# EAGLE design atmduinov2 (EAGLE 7.2.0)
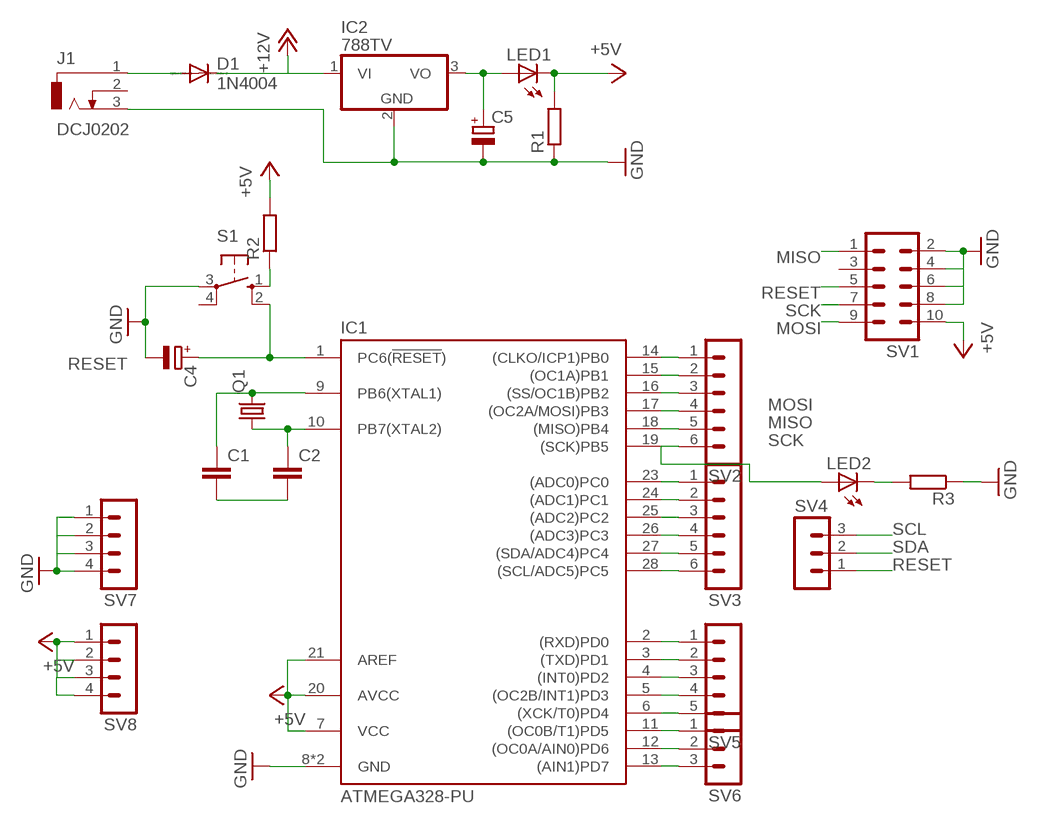
[diagram p0: schematic, sheet 1]

## Parts
C1  C-EU025-024X044  [C025-024X044]
C2  C-EU025-024X044  [C025-024X044]
C4  CPOL-EUE1.8-4  [E1,8-4]
C5  CPOL-EUE1.8-4  [E1,8-4]
D1  1N4004  [DO41-10]
IC1  ATMEGA328-PU  [DIL28]
IC2  788TV  [TO220V]
J1  DCJ0202  [DCJ0202]
LED1  LED3MM  [LED3MM]
LED2  LED3MM  [LED3MM]
Q1  CRYSTALHC49S  [HC49/S]
R1  R-EU_0204/5  [0204/5]
R2  R-EU_0204/5  [0204/5]
R3  R-EU_0204/5  [0204/5]
S1  10-XX  [B3F-10XX]
SV1  ML10  [ML10]
SV2  MA06-1  [MA06-1]
SV3  MA06-1  [MA06-1]
SV4  MA03-1  [MA03-1]
SV5  MA05-1  [MA05-1]
SV6  MA03-1  [MA03-1]
SV7  MA04-1  [MA04-1]
SV8  MA04-1  [MA04-1]

## Nets
+5V: IC1.7(VCC) IC1.20(AVCC) IC1.21(AREF) LED1.K(C) R1.2 R2.2 SV1.10 SV8.1 SV8.2 SV8.3 SV8.4
+12V: D1.C IC2.1(VI)
GND: C4.- C5.- IC1.8(GND) IC1.22(GND) IC2.2(GND) J1.3 R1.1 R3.1 S1.3(P) SV1.2 SV1.4 SV1.6 SV1.8 SV7.1 SV7.2 SV7.3 SV7.4
MISO: IC1.18((MISO)PB4) SV1.1 SV2.5
MOSI: IC1.17((OC2A/MOSI)PB3) SV1.9 SV2.4
N$1: D1.A J1.1
N$2: C5.+ IC2.3(VO) LED1.A
N$3: LED2.K(C) R3.2
N$4: IC1.14((CLKO/ICP1)PB0) SV2.1
N$5: IC1.15((OC1A)PB1) SV2.2
N$6: IC1.16((SS/OC1B)PB2) SV2.3
N$10: IC1.23((ADC0)PC0) SV3.1
N$11: IC1.24((ADC1)PC1) SV3.2
N$12: IC1.25((ADC2)PC2) SV3.3
N$13: IC1.26((ADC3)PC3) SV3.4
N$16: IC1.2((RXD)PD0) SV5.1
N$17: IC1.3((TXD)PD1) SV5.2
N$18: IC1.4((INT0)PD2) SV5.3
N$19: IC1.5((OC2B/INT1)PD3) SV5.4
N$20: IC1.6((XCK/T0)PD4) SV5.5
N$21: IC1.11((OC0B/T1)PD5) SV6.1
N$22: IC1.12((OC0A/AIN0)PD6) SV6.2
N$23: IC1.13((AIN1)PD7) SV6.3
N$24: C2.1 IC1.10(PB7(XTAL2)) Q1.1
N$25: C1.1 IC1.9(PB6(XTAL1)) Q1.2
N$26: C1.2 C2.2
N$29: R2.1 S1.1(S)
RESET: C4.+ IC1.1(PC6(!RESET!)) S1.2(S1) SV1.5 SV4.1
SCK: IC1.19((SCK)PB5) LED2.A SV1.7 SV2.6
SCL: IC1.28((SCL/ADC5)PC5) SV3.6 SV4.3
SDA: IC1.27((SDA/ADC4)PC4) SV3.5 SV4.2
Unconnected: J1.2 S1.4(P1) SV1.3

## Library data of the parts
C1 C2 = resistor:C-EU: CAPACITOR, European symbol
C4 C5 = resistor:CPOL-EU: POLARIZED CAPACITOR, European symbol
D1 = diode:1N4004: DIODE general purpose rectifier, 1 A
IC1 = ATMEGA328-PU:ATMEGA328-PU: Atmel ATmega48/88/168/328 AVR Microcontroller; AVAILABILITY: Good; DESCRIPTION: ATmega Series 20 MHz 32 KB Flash 2 KB SRAM 8-Bit Microcontroller - DIP-28; MF: Microchip; MP: ATMEGA328-PU; PACKAGE: PDIP-28 Microchip; PRICE: 1.95 USD
IC2 = linear:78*: Positive VOLTAGE REGULATOR Source: http://cache.national.com/ds/LM/LM78L05.pdf http://www.fairchildsemi.com/ds/LM/LM7805.pdf
J1 = con-jack:DCJ0202: DC POWER JACK Source: DCJ0202.pdf; OC_FARNELL: unknown; OC_NEWARK: unknown
LED1 LED2 = led:LED: LED OSRAM: - CHIPLED LG R971, LG N971, LY N971, LG Q971, LY Q971, LO R971, LY R971 LH N974, LH R974 LS Q976, LO Q976, LY Q976 LO Q996 - Hyper CHIPLED LW Q18S LB Q993, LB Q99A, LB R99A - SideLED LS A670, LO A670, LY A670, LG A670, LP A670 LB A673, LV A673, LT A673, LW A673 LH A674 LY A675 LS A676, LA A676, LO A676, LY A676, LW A676 LS A679, LY A679, LG A679 - Hyper Micro SIDELED® LS Y876, LA Y876, LO Y876, LY Y876 LT Y87S - SmartLED LW L88C, LW L88S LB L89C, LB L89S, LG L890 LS L89K, LO L89K, LY L89K LS L896, LA L896, LO L896, LY L896 - TOPLED LS T670, LO T670, LY T670, LG T670, LP T670 LSG T670, LSP T670, LSY T670, LOP T670, LYG T670 LG T671, LOG T671, LSG T671 LB T673, LV T673, LT T673, LW T673 LH T674 LS T676, LA T676, LO T676, LY T676, LB T676, LH T676, LSB T676, LW T676 LB T67C, LV T67C, LT T67C, LS T67K, LO T67K, LY T67K, LW E67C LS E67B, LA E67B, LO E67B, LY E67B, LB E67C, LV E67C, LT E67C LW T67C LS T679, LY T679, LG T679 LS T770, LO T770, LY T770, LG T770, LP T770 LB T773, LV T773, LT T773, LW T773 LH T774 LS E675, LA E675, LY E675, LS T675 LS T776, LA T776, LO T776, LY T776, LB T776 LHGB T686 LT T68C, LB T68C - Hyper Mini TOPLED® LB M676 - Mini TOPLED Santana® LG M470 LS M47K, LO M47K, LY M47K Source: http://www.osram.convergy.de LUXEON: - LUMILED® LXK2-PW12-R00, LXK2-PW12-S00, LXK2-PW14-U00, LXK2-PW14-V00 LXK2-PM12-R00, LXK2-PM12-S00, LXK2-PM14-U00 LXK2-PE12-Q00, LXK2-PE12-R00, LXK2-PE12-S00, LXK2-PE14-T00, LXK2-PE14-U00 LXK2-PB12-K00, LXK2-PB12-L00, LXK2-PB12-M00, LXK2-PB14-N00, LXK2-PB14-P00, LXK2-PB14-Q00 LXK2-PR12-L00, LXK2-PR12-M00, LXK2-PR14-Q00, LXK2-PR14-R00 LXK2-PD12-Q00, LXK2-PD12-R00, LXK2-PD12-S00 LXK2-PH12-R00, LXK2-PH12-S00 LXK2-PL12-P00, LXK2-PL12-Q00, LXK2-PL12-R00 Source: www.luxeon.com KINGBRIGHT: KA-3528ASYC Source: www.kingbright.com
Q1 = crystal:CRYSTAL: CRYSTAL; OC_FARNELL: 1667008; OC_NEWARK: unknown
R1-R3 = resistor:R-EU_: RESISTOR, European symbol
S1 = switch-omron:10-XX: OMRON SWITCH; MPN: B3F-1000; OC_FARNELL: 176432; OC_NEWARK: 36M3542
SV1 = con-ml:ML10: HARTING; OC_FARNELL: unknown; OC_NEWARK: unknown
SV2 SV3 = con-lstb:MA06-1: PIN HEADER; OC_FARNELL: unknown; OC_NEWARK: unknown
SV4 SV6 = con-lstb:MA03-1: PIN HEADER; OC_FARNELL: unknown; OC_NEWARK: unknown
SV5 = con-lstb:MA05-1: PIN HEADER; OC_FARNELL: unknown; OC_NEWARK: unknown
SV7 SV8 = con-lstb:MA04-1: PIN HEADER; OC_FARNELL: unknown; OC_NEWARK: unknown

## Board
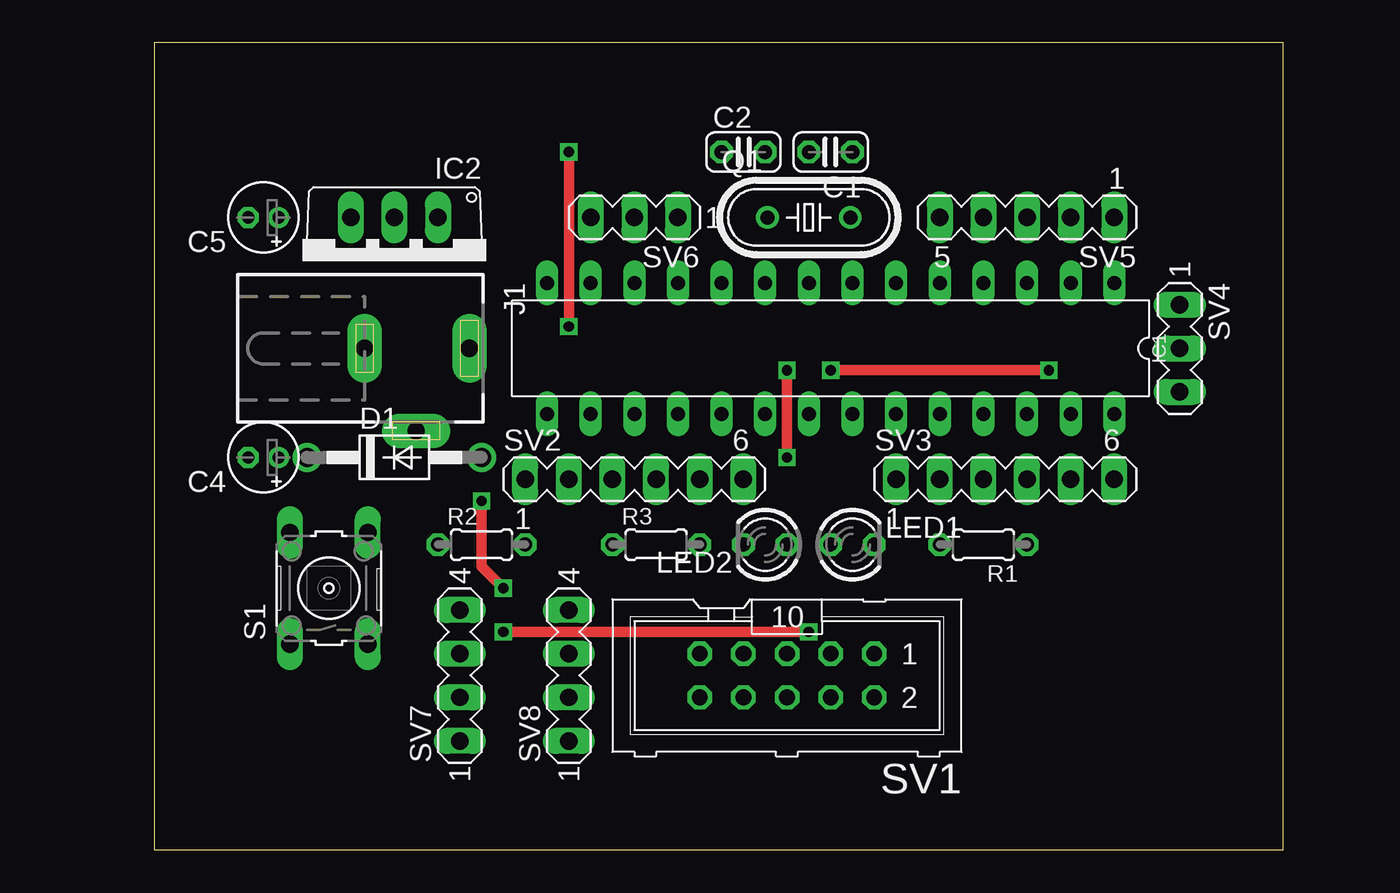
[diagram p1: board, top side]
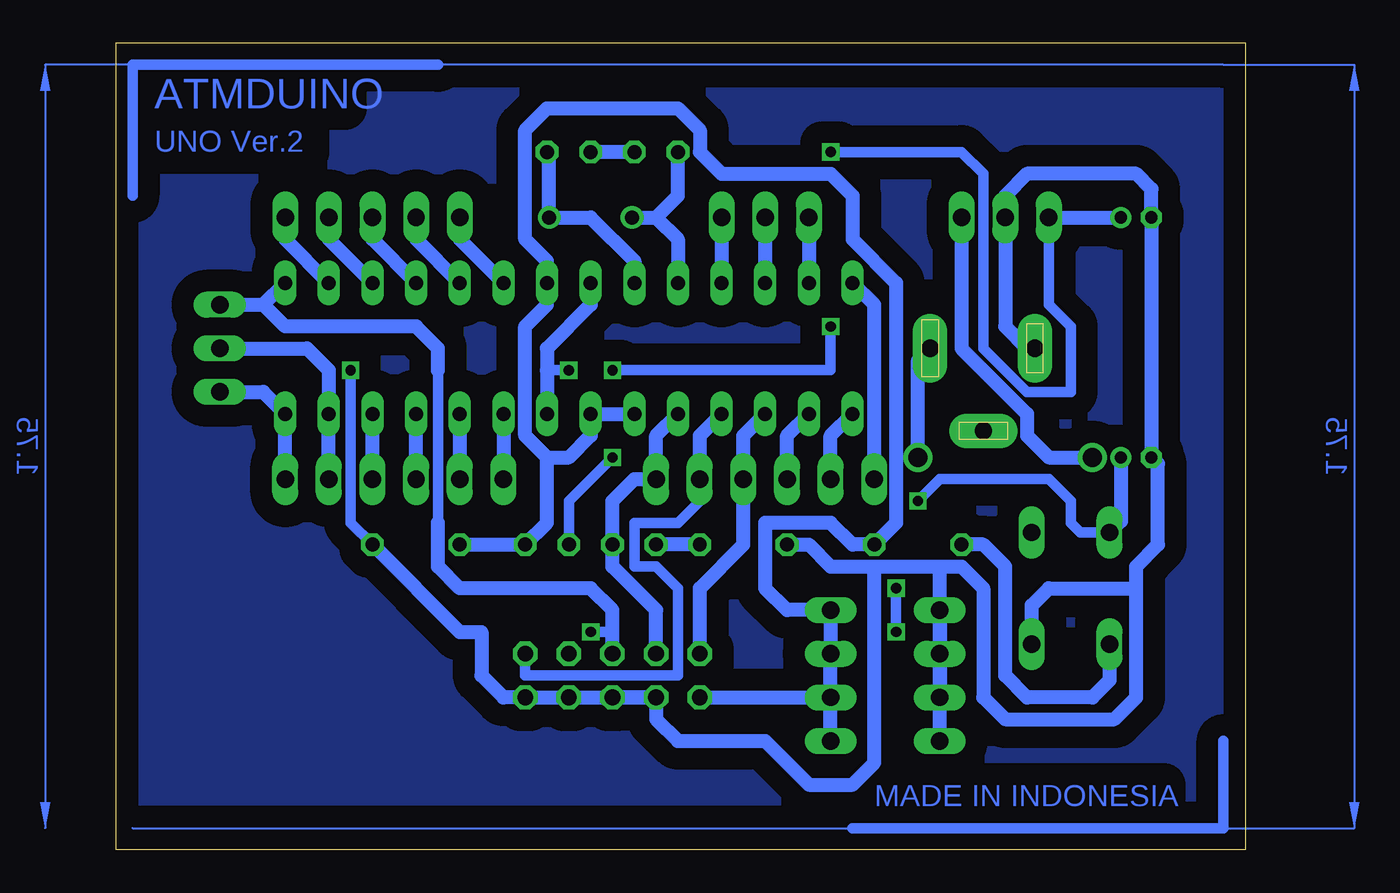
[diagram p2: board, bottom side, seen from below]

Size 65.71 x 46.97 mm. Coordinates in mm from the lower left corner, seen from the top.
Outline: 0,46.97 0,0 65.71,0 65.71,46.97 0,46.97
Copper layers (1*16): Top 0.035mm / dielectric 1.5mm / Bottom 0.035mm
Design rules "default": minimum track width 10mil, minimum drill 24mil, track to track 8mil, track to pad 8mil, pad to pad 8mil, via to via 8mil, smd to smd 8mil, copper to edge 40mil, drill to drill 8mil, minimum pad ring 10mil, minimum via ring 8mil, stop-mask expansion 4mil, vias tented up to drill 0mil, thermal gap 10mil

### Footprints (pad centres in the part's own frame; a part is rotated, then mirrored left to right if it is on the bottom)
C025-024X044 = drill 0.813 octagon: 1 -1.27,0; 2 1.27,0
E1,8-4 = drill 0.711 pad 1.168: + -0.889,0 | drill 0.711 pad 1.168 octagon: - 0.889,0
DO41-10 = drill 1.118: A 5.08,0; C -5.08,0
DIL28 = drill 0.813 long: 1 -3.81,16.51; 2 -3.81,13.97; 3 -3.81,11.43; 4 -3.81,8.89; 5 -3.81,6.35; 6 -3.81,3.81; 7 -3.81,1.27; 8 -3.81,-1.27; 9 -3.81,-3.81; 10 -3.81,-6.35; 11 -3.81,-8.89; 12 -3.81,-11.43; 13 -3.81,-13.97; 14 -3.81,-16.51; 15 3.81,-16.51; 16 3.81,-13.97; 17 3.81,-11.43; 18 3.81,-8.89; 19 3.81,-6.35; 20 3.81,-3.81; 21 3.81,-1.27; 22 3.81,1.27; 23 3.81,3.81; 24 3.81,6.35; 25 3.81,8.89; 26 3.81,11.43; 27 3.81,13.97; 28 3.81,16.51
TO220V = drill 1.016 long: 1 -2.54,-2.54; 2 0,-2.54; 3 2.54,-2.54
DCJ0202 = drill 1 pad 2 long: 1 0,3.1; 2 4.8,0; 3 0,-3
LED3MM = drill 0.813 octagon: A -1.27,0; K 1.27,0
HC49/S = drill 0.813: 1 -2.413,0; 2 2.413,0
0204/5 = drill 0.813 octagon: 1 -2.54,0; 2 2.54,0
B3F-10XX = drill 1.016 long: 1 -3.251,2.261; 2 3.251,2.261; 3 -3.251,-2.261; 4 3.251,-2.261
ML10 = drill 0.914 octagon: 1 -5.08,-1.27; 2 -5.08,1.27; 3 -2.54,-1.27; 4 -2.54,1.27; 5 0,-1.27; 6 0,1.27; 7 2.54,-1.27; 8 2.54,1.27; 9 5.08,-1.27; 10 5.08,1.27
MA06-1 = drill 1.016 long: 1 -6.35,0; 2 -3.81,0; 3 -1.27,0; 4 1.27,0; 5 3.81,0; 6 6.35,0
MA03-1 = drill 1.016 long: 1 -2.54,0; 2 0,0; 3 2.54,0
MA05-1 = drill 1.016 long: 1 -5.08,0; 2 -2.54,0; 3 0,0; 4 2.54,0; 5 5.08,0
MA04-1 = drill 1.016 long: 1 -3.81,0; 2 -1.27,0; 3 1.27,0; 4 3.81,0

### Placement (x,y rotation side)
C1  39.37,40.62 180 top
C2  34.29,40.62 0 top
C4  6.35,22.84 180 top
C5  6.35,36.81 180 top
D1  13.97,22.84 0 top
IC1  39.37,29.19 270 top
IC2  13.97,34.27 180 top
J1  15.24,29.19 270 top
LED1  40.64,17.76 0 top
LED2  35.56,17.76 180 top
Q1  38.1,36.81 0 top
R1  48.26,17.76 180 top
R2  19.05,17.76 0 top
R3  29.21,17.76 0 top
S1  10.16,15.22 90 top
SV1  36.83,10.14 180 top
SV2  27.94,21.57 0 top
SV3  49.53,21.57 0 top
SV4  59.69,29.19 270 top
SV5  50.8,36.81 180 top
SV6  27.94,36.81 180 top
SV7  17.78,10.14 90 top
SV8  24.13,10.14 90 top

### Tracks (layer width: path | path; a pad name or v marks a point on that pad's centre or on a via)
+5V
  Bottom 0.813: R1.2 LED1.K 40.64,19.03 40.64,22.84 | SV8.1 SV8.2 | SV8.2 SV8.3 SV8.4 26.67,13.95 27.94,15.22 27.94,19.03 24.13,19.03 22.86,17.76 R2.2 20.32,19.03 20.32,33 22.86,35.54 22.86,38.08 24.13,39.35 30.48,39.35 31.75,40.62 31.75,41.89 33.02,43.16 40.64,43.16 41.91,41.89 41.91,35.54 40.64,34.27 IC1.7 40.64,31.73 41.91,30.46 41.91,24.11 40.64,22.84 | IC1.20 IC1.21 38.1,24.11 39.37,22.84 40.64,22.84 | SV1.10 SV8.2
+12V
  Bottom 0.813: IC2.1 16.51,29.19 12.7,25.38 12.7,24.11 11.43,22.84 D1.C
GND  (via drill 0.6)
  Top 0.61: v52.07,27.92 v39.37,27.92
  Bottom 0.61: R1.1 52.07,19.03 v52.07,27.92 | v39.37,27.92 40.64,27.92
  Bottom 0.813: SV1.2 SV1.4 SV1.6 SV1.8 | J1.3 12.7,29.19 13.97,30.46 IC2.2 13.97,38.08 12.7,39.35 6.35,39.35 5.46,38.46 C5.- C4.- 5.08,22.46 5.08,17.76 6.35,16.49 6.35,15.22 | SV7.1 SV7.2 | SV7.2 SV7.3 SV7.4 SV7.2 | S1.3 12.42,14.23 11.43,15.22 6.35,15.22 | SV1.2 43.18,8.87 44.45,10.14 44.45,12.68 45.72,12.68 R1.1 | IC1.8 38.1,31.73 40.64,29.19 40.64,27.92 IC1.22 | R3.1 25.4,17.76 24.13,16.49 21.59,16.49 | 17.78,16.49 16.51,16.49 15.24,15.22 15.24,8.87 13.97,7.6 7.62,7.6 6.35,8.87 6.35,15.22 | SV7.2 17.78,16.49 | SV1.2 SV1.8 | SV1.8 34.29,7.6 33.02,6.33 27.94,6.33 25.4,3.79 22.86,3.79 21.59,5.06 21.59,16.49 | 21.59,16.49 17.78,16.49
MISO
  Bottom 0.61: SV1.1 41.91,10.14 33.02,10.14 33.02,15.22 34.29,16.49 35.56,16.49 35.56,19.03 33.02,19.03 31.75,20.3 SV2.5
  Bottom 0.813: SV2.5 31.75,24.11 IC1.18
MOSI
  Bottom 0.813: IC1.17 29.21,24.11 SV2.4 29.21,17.76 31.75,15.22 SV1.9
N$1
  Bottom 0.813: D1.A 19.05,28.48 J1.1
N$2  (via drill 0.6)
  Top 0.61: v36.83,22.84 v36.83,27.92 | v24.13,30.46 v24.13,40.62
  Bottom 0.61: LED1.A 39.37,20.3 v36.83,22.84 | v36.83,27.92 24.13,27.92 v24.13,30.46 | v24.13,40.62 16.51,40.62 15.24,39.35 15.24,29.19 12.7,26.65 10.16,26.65 10.16,30.46 11.43,31.73 IC2.3
  Bottom 0.813: IC2.3 C5.+
N$3
  Bottom 0.813: R3.2 LED2.K
N$4
  Bottom 0.813: SV2.1 21.59,31.73 IC1.14
N$5
  Bottom 0.813: SV2.2 24.13,24.11 IC1.15
N$6
  Bottom 0.813: SV2.3 26.67,24.11 IC1.16
N$7
  pour Bottom (isolate 1.27, rank 3): 1.27,45.7 64.77,45.7 64.77,1.25 1.27,1.25 1.27,6.33
N$9
  Bottom 0.61: 46.99,45.7 64.77,45.7 64.77,38.08
N$10
  Bottom 0.813: IC1.23 SV3.1
N$11
  Bottom 0.813: IC1.24 SV3.2
N$12
  Bottom 0.813: SV3.3 IC1.25
N$13
  Bottom 0.813: SV3.4 IC1.26
N$14
  Bottom 0.61: 22.86,1.25 1.27,1.25 1.27,6.33
N$16
  Bottom 0.813: SV5.1 55.88,35.54 IC1.2
N$17
  Bottom 0.813: SV5.2 53.34,35.54 IC1.3
N$18
  Bottom 0.813: SV5.3 50.8,35.54 IC1.4
N$19
  Bottom 0.813: SV5.4 48.26,35.54 IC1.5
N$20
  Bottom 0.813: SV5.5 45.72,35.54 IC1.6
N$21
  Bottom 0.813: SV6.1 IC1.11
N$22
  Bottom 0.813: SV6.2 IC1.12
N$23
  Bottom 0.813: SV6.3 IC1.13
N$24
  Bottom 0.813: 34.29,36.81 33.02,35.54 IC1.10 | Q1.1 34.29,36.81 | 34.29,36.81 33.02,38.08 C2.1
N$25
  Bottom 0.813: IC1.9 35.56,34.27 38.1,36.81 Q1.2 40.51,40.49 C1.1
N$26
  Bottom 0.813: C2.2 C1.2
N$29
  Bottom 0.813: S1.1 7.9,9.86 8.89,8.87 12.7,8.87 13.97,10.14 13.97,16.49 15.24,17.76 R2.1
RESET  (via drill 0.6)
  Top 0.61: v19.05,20.3 19.05,16.49 v20.32,15.22 | v20.32,12.68 v38.1,12.68
  Bottom 0.61: 46.99,19.03 46.99,27.92 | S1.2 9.6,18.47 10.16,19.03 10.16,20.3 11.43,21.57 17.78,21.57 v19.05,20.3 | v20.32,15.22 v20.32,12.68 | v38.1,12.68 36.83,12.68
  Bottom 0.813: SV4.1 57.15,31.73 | 57.15,31.73 IC1.1 | C4.+ 7.24,19.13 S1.2 | SV1.5 36.83,12.68 36.83,13.95 38.1,15.22 45.72,15.22 46.99,16.49 46.99,19.03 | 46.99,27.92 46.99,29.19 48.26,30.46 55.88,30.46 57.15,31.73
SCK
  Bottom 0.813: IC1.19 34.29,24.11 SV2.6 35.56,21.57 36.83,20.3 LED2.A 36.83,16.49 34.29,13.95 SV1.7
SCL
  Bottom 0.813: SV3.6 IC1.28 57.15,26.65 SV4.3
SDA
  Bottom 0.813: SV3.5 IC1.27 53.34,27.92 54.61,29.19 SV4.2
(copper drawn outside any net)
  shapes: Bottom area x4

### Text on the board
Bottom: ATMDUINO | UNO Ver.2 | MADE IN INDONESIA